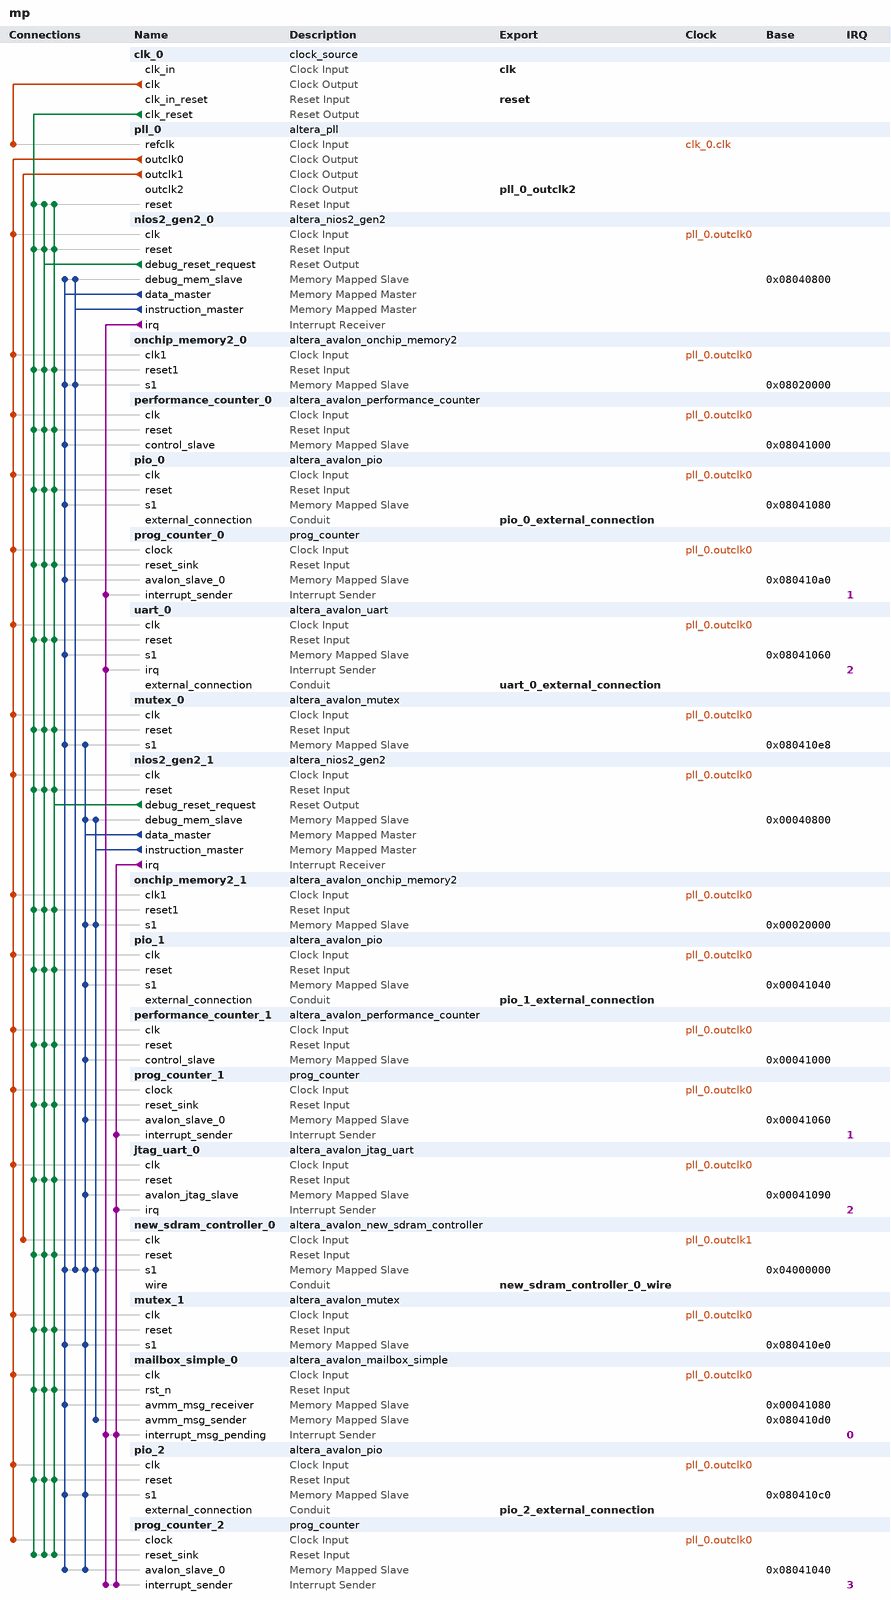
[diagram p0: system contents]
# Platform Designer (Qsys) system mp, Cyclone V 5CSEMA5F31C6
# Parameters at their usual value, and those the tool derives, are not listed.
package require -exact qsys 16.0
create_system mp
set_project_property DEVICE_FAMILY {Cyclone V}
set_project_property DEVICE 5CSEMA5F31C6

add_instance clk_0 clock_source 16.0
set_instance_parameter_value clk_0 clockFrequency 50000000

add_instance pll_0 altera_pll 16.0
set_instance_parameter_value pll_0 gui_device_speed_grade 1
set_instance_parameter_value pll_0 gui_number_of_clocks 3
set_instance_parameter_value pll_0 gui_operation_mode direct
set_instance_parameter_value pll_0 gui_output_clock_frequency0 50.0
set_instance_parameter_value pll_0 gui_output_clock_frequency1 100.0
set_instance_parameter_value pll_0 gui_output_clock_frequency2 100.0
set_instance_parameter_value pll_0 gui_phase_shift2 -3758
set_instance_parameter_value pll_0 gui_pll_mode {Integer-N PLL}
set_instance_parameter_value pll_0 gui_reference_clock_frequency 50.0
set_instance_parameter_value pll_0 gui_use_locked true

add_instance nios2_gen2_0 altera_nios2_gen2 16.0
set_instance_parameter_value nios2_gen2_0 dcache_size 2048
set_instance_parameter_value nios2_gen2_0 exceptionSlave onchip_memory2_0.s1
set_instance_parameter_value nios2_gen2_0 icache_size 4096
set_instance_parameter_value nios2_gen2_0 impl Fast
set_instance_parameter_value nios2_gen2_0 resetSlave onchip_memory2_0.s1

add_instance onchip_memory2_0 altera_avalon_onchip_memory2 16.0
set_instance_parameter_value onchip_memory2_0 dataWidth 32
set_instance_parameter_value onchip_memory2_0 dualPort false
set_instance_parameter_value onchip_memory2_0 initMemContent true
set_instance_parameter_value onchip_memory2_0 initializationFileName onchip_mem.hex
set_instance_parameter_value onchip_memory2_0 memorySize 131072

add_instance performance_counter_0 altera_avalon_performance_counter 16.0
set_instance_parameter_value performance_counter_0 numberOfSections 3

add_instance pio_0 altera_avalon_pio 16.0
set_instance_parameter_value pio_0 bitModifyingOutReg true
set_instance_parameter_value pio_0 direction Output
set_instance_parameter_value pio_0 width 8

add_instance prog_counter_0 prog_counter 1.0

add_instance uart_0 altera_avalon_uart 16.0
set_instance_parameter_value uart_0 baud 115200
set_instance_parameter_value uart_0 dataBits 8
set_instance_parameter_value uart_0 fixedBaud true
set_instance_parameter_value uart_0 parity NONE
set_instance_parameter_value uart_0 stopBits 1

add_instance mutex_0 altera_avalon_mutex 16.0

add_instance nios2_gen2_1 altera_nios2_gen2 16.0
set_instance_parameter_value nios2_gen2_1 dcache_size 2048
set_instance_parameter_value nios2_gen2_1 exceptionSlave onchip_memory2_1.s1
set_instance_parameter_value nios2_gen2_1 icache_size 4096
set_instance_parameter_value nios2_gen2_1 impl Fast
set_instance_parameter_value nios2_gen2_1 resetSlave onchip_memory2_1.s1

add_instance onchip_memory2_1 altera_avalon_onchip_memory2 16.0
set_instance_parameter_value onchip_memory2_1 dataWidth 32
set_instance_parameter_value onchip_memory2_1 dualPort false
set_instance_parameter_value onchip_memory2_1 initMemContent true
set_instance_parameter_value onchip_memory2_1 initializationFileName onchip_mem.hex
set_instance_parameter_value onchip_memory2_1 memorySize 131072

add_instance pio_1 altera_avalon_pio 16.0
set_instance_parameter_value pio_1 bitModifyingOutReg true
set_instance_parameter_value pio_1 direction Output
set_instance_parameter_value pio_1 width 8

add_instance performance_counter_1 altera_avalon_performance_counter 16.0
set_instance_parameter_value performance_counter_1 numberOfSections 3

add_instance prog_counter_1 prog_counter 1.0

add_instance jtag_uart_0 altera_avalon_jtag_uart 16.0
set_instance_parameter_value jtag_uart_0 simInteractiveOptions NO_INTERACTIVE_WINDOWS

add_instance new_sdram_controller_0 altera_avalon_new_sdram_controller 16.0
set_instance_parameter_value new_sdram_controller_0 TAC 5.4
set_instance_parameter_value new_sdram_controller_0 TRCD 15.0
set_instance_parameter_value new_sdram_controller_0 TRP 15.0
set_instance_parameter_value new_sdram_controller_0 casLatency 3
set_instance_parameter_value new_sdram_controller_0 columnWidth 10
set_instance_parameter_value new_sdram_controller_0 dataWidth 16
set_instance_parameter_value new_sdram_controller_0 generateSimulationModel false
set_instance_parameter_value new_sdram_controller_0 model single_Micron_MT48LC4M32B2_7_chip
set_instance_parameter_value new_sdram_controller_0 numberOfBanks 4
set_instance_parameter_value new_sdram_controller_0 numberOfChipSelects 1
set_instance_parameter_value new_sdram_controller_0 powerUpDelay 100.0
set_instance_parameter_value new_sdram_controller_0 refreshPeriod 7.8125
set_instance_parameter_value new_sdram_controller_0 rowWidth 13

add_instance mutex_1 altera_avalon_mutex 16.0

add_instance mailbox_simple_0 altera_avalon_mailbox_simple 16.0
set_instance_parameter_value mailbox_simple_0 AWIDTH 2
set_instance_parameter_value mailbox_simple_0 DWIDTH 32
set_instance_parameter_value mailbox_simple_0 MSG_ARRIVAL_NOTIFY 1
set_instance_parameter_value mailbox_simple_0 MSG_SPACE_NOTIFY 0

add_instance pio_2 altera_avalon_pio 16.0
set_instance_parameter_value pio_2 direction Bidir
set_instance_parameter_value pio_2 width 8

add_instance prog_counter_2 prog_counter 1.0

# connections
add_connection clk_0.clk pll_0.refclk clock
add_connection pll_0.outclk0 jtag_uart_0.clk clock
add_connection pll_0.outclk0 mailbox_simple_0.clk clock
add_connection pll_0.outclk0 mutex_0.clk clock
add_connection pll_0.outclk0 mutex_1.clk clock
add_connection pll_0.outclk0 nios2_gen2_0.clk clock
add_connection pll_0.outclk0 nios2_gen2_1.clk clock
add_connection pll_0.outclk0 onchip_memory2_0.clk1 clock
add_connection pll_0.outclk0 onchip_memory2_1.clk1 clock
add_connection pll_0.outclk0 performance_counter_0.clk clock
add_connection pll_0.outclk0 performance_counter_1.clk clock
add_connection pll_0.outclk0 pio_0.clk clock
add_connection pll_0.outclk0 pio_1.clk clock
add_connection pll_0.outclk0 pio_2.clk clock
add_connection pll_0.outclk0 prog_counter_0.clock clock
add_connection pll_0.outclk0 prog_counter_1.clock clock
add_connection pll_0.outclk0 prog_counter_2.clock clock
add_connection pll_0.outclk0 uart_0.clk clock
add_connection pll_0.outclk1 new_sdram_controller_0.clk clock
add_connection clk_0.clk_reset jtag_uart_0.reset reset
add_connection clk_0.clk_reset mailbox_simple_0.rst_n reset
add_connection clk_0.clk_reset mutex_0.reset reset
add_connection clk_0.clk_reset mutex_1.reset reset
add_connection clk_0.clk_reset new_sdram_controller_0.reset reset
add_connection clk_0.clk_reset nios2_gen2_0.reset reset
add_connection clk_0.clk_reset nios2_gen2_1.reset reset
add_connection clk_0.clk_reset onchip_memory2_0.reset1 reset
add_connection clk_0.clk_reset onchip_memory2_1.reset1 reset
add_connection clk_0.clk_reset performance_counter_0.reset reset
add_connection clk_0.clk_reset performance_counter_1.reset reset
add_connection clk_0.clk_reset pio_0.reset reset
add_connection clk_0.clk_reset pio_1.reset reset
add_connection clk_0.clk_reset pio_2.reset reset
add_connection clk_0.clk_reset pll_0.reset reset
add_connection clk_0.clk_reset prog_counter_0.reset_sink reset
add_connection clk_0.clk_reset prog_counter_1.reset_sink reset
add_connection clk_0.clk_reset prog_counter_2.reset_sink reset
add_connection clk_0.clk_reset uart_0.reset reset
add_connection nios2_gen2_0.debug_reset_request jtag_uart_0.reset reset
add_connection nios2_gen2_0.debug_reset_request mailbox_simple_0.rst_n reset
add_connection nios2_gen2_0.debug_reset_request mutex_0.reset reset
add_connection nios2_gen2_0.debug_reset_request mutex_1.reset reset
add_connection nios2_gen2_0.debug_reset_request new_sdram_controller_0.reset reset
add_connection nios2_gen2_0.debug_reset_request nios2_gen2_0.reset reset
add_connection nios2_gen2_0.debug_reset_request nios2_gen2_1.reset reset
add_connection nios2_gen2_0.debug_reset_request onchip_memory2_0.reset1 reset
add_connection nios2_gen2_0.debug_reset_request onchip_memory2_1.reset1 reset
add_connection nios2_gen2_0.debug_reset_request performance_counter_0.reset reset
add_connection nios2_gen2_0.debug_reset_request performance_counter_1.reset reset
add_connection nios2_gen2_0.debug_reset_request pio_0.reset reset
add_connection nios2_gen2_0.debug_reset_request pio_1.reset reset
add_connection nios2_gen2_0.debug_reset_request pio_2.reset reset
add_connection nios2_gen2_0.debug_reset_request pll_0.reset reset
add_connection nios2_gen2_0.debug_reset_request prog_counter_0.reset_sink reset
add_connection nios2_gen2_0.debug_reset_request prog_counter_1.reset_sink reset
add_connection nios2_gen2_0.debug_reset_request prog_counter_2.reset_sink reset
add_connection nios2_gen2_0.debug_reset_request uart_0.reset reset
add_connection nios2_gen2_1.debug_reset_request jtag_uart_0.reset reset
add_connection nios2_gen2_1.debug_reset_request mailbox_simple_0.rst_n reset
add_connection nios2_gen2_1.debug_reset_request mutex_0.reset reset
add_connection nios2_gen2_1.debug_reset_request mutex_1.reset reset
add_connection nios2_gen2_1.debug_reset_request new_sdram_controller_0.reset reset
add_connection nios2_gen2_1.debug_reset_request nios2_gen2_0.reset reset
add_connection nios2_gen2_1.debug_reset_request nios2_gen2_1.reset reset
add_connection nios2_gen2_1.debug_reset_request onchip_memory2_0.reset1 reset
add_connection nios2_gen2_1.debug_reset_request onchip_memory2_1.reset1 reset
add_connection nios2_gen2_1.debug_reset_request performance_counter_0.reset reset
add_connection nios2_gen2_1.debug_reset_request performance_counter_1.reset reset
add_connection nios2_gen2_1.debug_reset_request pio_0.reset reset
add_connection nios2_gen2_1.debug_reset_request pio_1.reset reset
add_connection nios2_gen2_1.debug_reset_request pio_2.reset reset
add_connection nios2_gen2_1.debug_reset_request pll_0.reset reset
add_connection nios2_gen2_1.debug_reset_request prog_counter_0.reset_sink reset
add_connection nios2_gen2_1.debug_reset_request prog_counter_1.reset_sink reset
add_connection nios2_gen2_1.debug_reset_request prog_counter_2.reset_sink reset
add_connection nios2_gen2_1.debug_reset_request uart_0.reset reset
add_connection nios2_gen2_0.data_master mailbox_simple_0.avmm_msg_receiver avalon
set_connection_parameter_value nios2_gen2_0.data_master/mailbox_simple_0.avmm_msg_receiver baseAddress 0x00041080
add_connection nios2_gen2_0.data_master mutex_0.s1 avalon
set_connection_parameter_value nios2_gen2_0.data_master/mutex_0.s1 baseAddress 0x080410e8
add_connection nios2_gen2_0.data_master mutex_1.s1 avalon
set_connection_parameter_value nios2_gen2_0.data_master/mutex_1.s1 baseAddress 0x080410e0
add_connection nios2_gen2_0.data_master new_sdram_controller_0.s1 avalon
set_connection_parameter_value nios2_gen2_0.data_master/new_sdram_controller_0.s1 baseAddress 0x04000000
add_connection nios2_gen2_0.data_master nios2_gen2_0.debug_mem_slave avalon
set_connection_parameter_value nios2_gen2_0.data_master/nios2_gen2_0.debug_mem_slave baseAddress 0x08040800
add_connection nios2_gen2_0.data_master onchip_memory2_0.s1 avalon
set_connection_parameter_value nios2_gen2_0.data_master/onchip_memory2_0.s1 baseAddress 0x08020000
add_connection nios2_gen2_0.data_master performance_counter_0.control_slave avalon
set_connection_parameter_value nios2_gen2_0.data_master/performance_counter_0.control_slave baseAddress 0x08041000
add_connection nios2_gen2_0.data_master pio_0.s1 avalon
set_connection_parameter_value nios2_gen2_0.data_master/pio_0.s1 baseAddress 0x08041080
add_connection nios2_gen2_0.data_master pio_2.s1 avalon
set_connection_parameter_value nios2_gen2_0.data_master/pio_2.s1 baseAddress 0x080410c0
add_connection nios2_gen2_0.data_master prog_counter_0.avalon_slave_0 avalon
set_connection_parameter_value nios2_gen2_0.data_master/prog_counter_0.avalon_slave_0 baseAddress 0x080410a0
add_connection nios2_gen2_0.data_master prog_counter_2.avalon_slave_0 avalon
set_connection_parameter_value nios2_gen2_0.data_master/prog_counter_2.avalon_slave_0 baseAddress 0x08041040
add_connection nios2_gen2_0.data_master uart_0.s1 avalon
set_connection_parameter_value nios2_gen2_0.data_master/uart_0.s1 baseAddress 0x08041060
add_connection nios2_gen2_0.instruction_master new_sdram_controller_0.s1 avalon
set_connection_parameter_value nios2_gen2_0.instruction_master/new_sdram_controller_0.s1 baseAddress 0x04000000
add_connection nios2_gen2_0.instruction_master nios2_gen2_0.debug_mem_slave avalon
set_connection_parameter_value nios2_gen2_0.instruction_master/nios2_gen2_0.debug_mem_slave baseAddress 0x08040800
add_connection nios2_gen2_0.instruction_master onchip_memory2_0.s1 avalon
set_connection_parameter_value nios2_gen2_0.instruction_master/onchip_memory2_0.s1 baseAddress 0x08020000
add_connection nios2_gen2_1.data_master jtag_uart_0.avalon_jtag_slave avalon
set_connection_parameter_value nios2_gen2_1.data_master/jtag_uart_0.avalon_jtag_slave baseAddress 0x00041090
add_connection nios2_gen2_1.data_master mutex_0.s1 avalon
set_connection_parameter_value nios2_gen2_1.data_master/mutex_0.s1 baseAddress 0x080410e8
add_connection nios2_gen2_1.data_master mutex_1.s1 avalon
set_connection_parameter_value nios2_gen2_1.data_master/mutex_1.s1 baseAddress 0x080410e0
add_connection nios2_gen2_1.data_master new_sdram_controller_0.s1 avalon
set_connection_parameter_value nios2_gen2_1.data_master/new_sdram_controller_0.s1 baseAddress 0x04000000
add_connection nios2_gen2_1.data_master nios2_gen2_1.debug_mem_slave avalon
set_connection_parameter_value nios2_gen2_1.data_master/nios2_gen2_1.debug_mem_slave baseAddress 0x00040800
add_connection nios2_gen2_1.data_master onchip_memory2_1.s1 avalon
set_connection_parameter_value nios2_gen2_1.data_master/onchip_memory2_1.s1 baseAddress 0x00020000
add_connection nios2_gen2_1.data_master performance_counter_1.control_slave avalon
set_connection_parameter_value nios2_gen2_1.data_master/performance_counter_1.control_slave baseAddress 0x00041000
add_connection nios2_gen2_1.data_master pio_1.s1 avalon
set_connection_parameter_value nios2_gen2_1.data_master/pio_1.s1 baseAddress 0x00041040
add_connection nios2_gen2_1.data_master pio_2.s1 avalon
set_connection_parameter_value nios2_gen2_1.data_master/pio_2.s1 baseAddress 0x080410c0
add_connection nios2_gen2_1.data_master prog_counter_1.avalon_slave_0 avalon
set_connection_parameter_value nios2_gen2_1.data_master/prog_counter_1.avalon_slave_0 baseAddress 0x00041060
add_connection nios2_gen2_1.data_master prog_counter_2.avalon_slave_0 avalon
set_connection_parameter_value nios2_gen2_1.data_master/prog_counter_2.avalon_slave_0 baseAddress 0x08041040
add_connection nios2_gen2_1.instruction_master mailbox_simple_0.avmm_msg_sender avalon
set_connection_parameter_value nios2_gen2_1.instruction_master/mailbox_simple_0.avmm_msg_sender baseAddress 0x080410d0
add_connection nios2_gen2_1.instruction_master new_sdram_controller_0.s1 avalon
set_connection_parameter_value nios2_gen2_1.instruction_master/new_sdram_controller_0.s1 baseAddress 0x04000000
add_connection nios2_gen2_1.instruction_master nios2_gen2_1.debug_mem_slave avalon
set_connection_parameter_value nios2_gen2_1.instruction_master/nios2_gen2_1.debug_mem_slave baseAddress 0x00040800
add_connection nios2_gen2_1.instruction_master onchip_memory2_1.s1 avalon
set_connection_parameter_value nios2_gen2_1.instruction_master/onchip_memory2_1.s1 baseAddress 0x00020000
add_connection nios2_gen2_0.irq mailbox_simple_0.interrupt_msg_pending interrupt
set_connection_parameter_value nios2_gen2_0.irq/mailbox_simple_0.interrupt_msg_pending irqNumber 0
add_connection nios2_gen2_0.irq prog_counter_0.interrupt_sender interrupt
set_connection_parameter_value nios2_gen2_0.irq/prog_counter_0.interrupt_sender irqNumber 1
add_connection nios2_gen2_0.irq prog_counter_2.interrupt_sender interrupt
set_connection_parameter_value nios2_gen2_0.irq/prog_counter_2.interrupt_sender irqNumber 3
add_connection nios2_gen2_0.irq uart_0.irq interrupt
set_connection_parameter_value nios2_gen2_0.irq/uart_0.irq irqNumber 2
add_connection nios2_gen2_1.irq jtag_uart_0.irq interrupt
set_connection_parameter_value nios2_gen2_1.irq/jtag_uart_0.irq irqNumber 2
add_connection nios2_gen2_1.irq mailbox_simple_0.interrupt_msg_pending interrupt
set_connection_parameter_value nios2_gen2_1.irq/mailbox_simple_0.interrupt_msg_pending irqNumber 0
add_connection nios2_gen2_1.irq prog_counter_1.interrupt_sender interrupt
set_connection_parameter_value nios2_gen2_1.irq/prog_counter_1.interrupt_sender irqNumber 1
add_connection nios2_gen2_1.irq prog_counter_2.interrupt_sender interrupt
set_connection_parameter_value nios2_gen2_1.irq/prog_counter_2.interrupt_sender irqNumber 3

# exported interfaces
add_interface clk clock sink
set_interface_property clk EXPORT_OF clk_0.clk_in
add_interface new_sdram_controller_0_wire conduit end
set_interface_property new_sdram_controller_0_wire EXPORT_OF new_sdram_controller_0.wire
add_interface pio_0_external_connection conduit end
set_interface_property pio_0_external_connection EXPORT_OF pio_0.external_connection
add_interface pio_1_external_connection conduit end
set_interface_property pio_1_external_connection EXPORT_OF pio_1.external_connection
add_interface pio_2_external_connection conduit end
set_interface_property pio_2_external_connection EXPORT_OF pio_2.external_connection
add_interface pll_0_outclk2 clock source
set_interface_property pll_0_outclk2 EXPORT_OF pll_0.outclk2
add_interface reset reset sink
set_interface_property reset EXPORT_OF clk_0.clk_in_reset
add_interface uart_0_external_connection conduit end
set_interface_property uart_0_external_connection EXPORT_OF uart_0.external_connection

set_interconnect_requirement {$system} qsys_mm.clockCrossingAdapter HANDSHAKE
set_interconnect_requirement {$system} qsys_mm.enableEccProtection FALSE
set_interconnect_requirement {$system} qsys_mm.insertDefaultSlave FALSE
set_interconnect_requirement {$system} qsys_mm.maxAdditionalLatency 1

save_system mp.qsys
